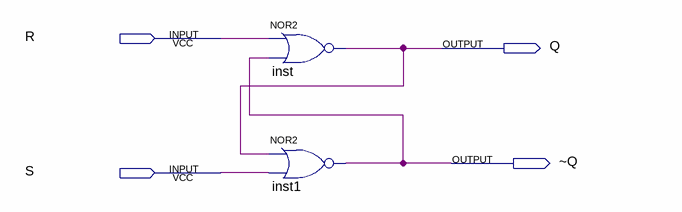
[diagram p0: schematic sheet]
// Quartus schematic srLatch.bdf as structural Verilog: 2 symbols, 4 pins
module srLatch (
  input  R,
  input  S,
  output Q,
  output \~Q 
);

  nor inst (Q, R, \~Q );
  nor inst1 (\~Q , Q, S);
endmodule
